# EAGLE design MoteinoR6USB (EAGLE 8.2.0)
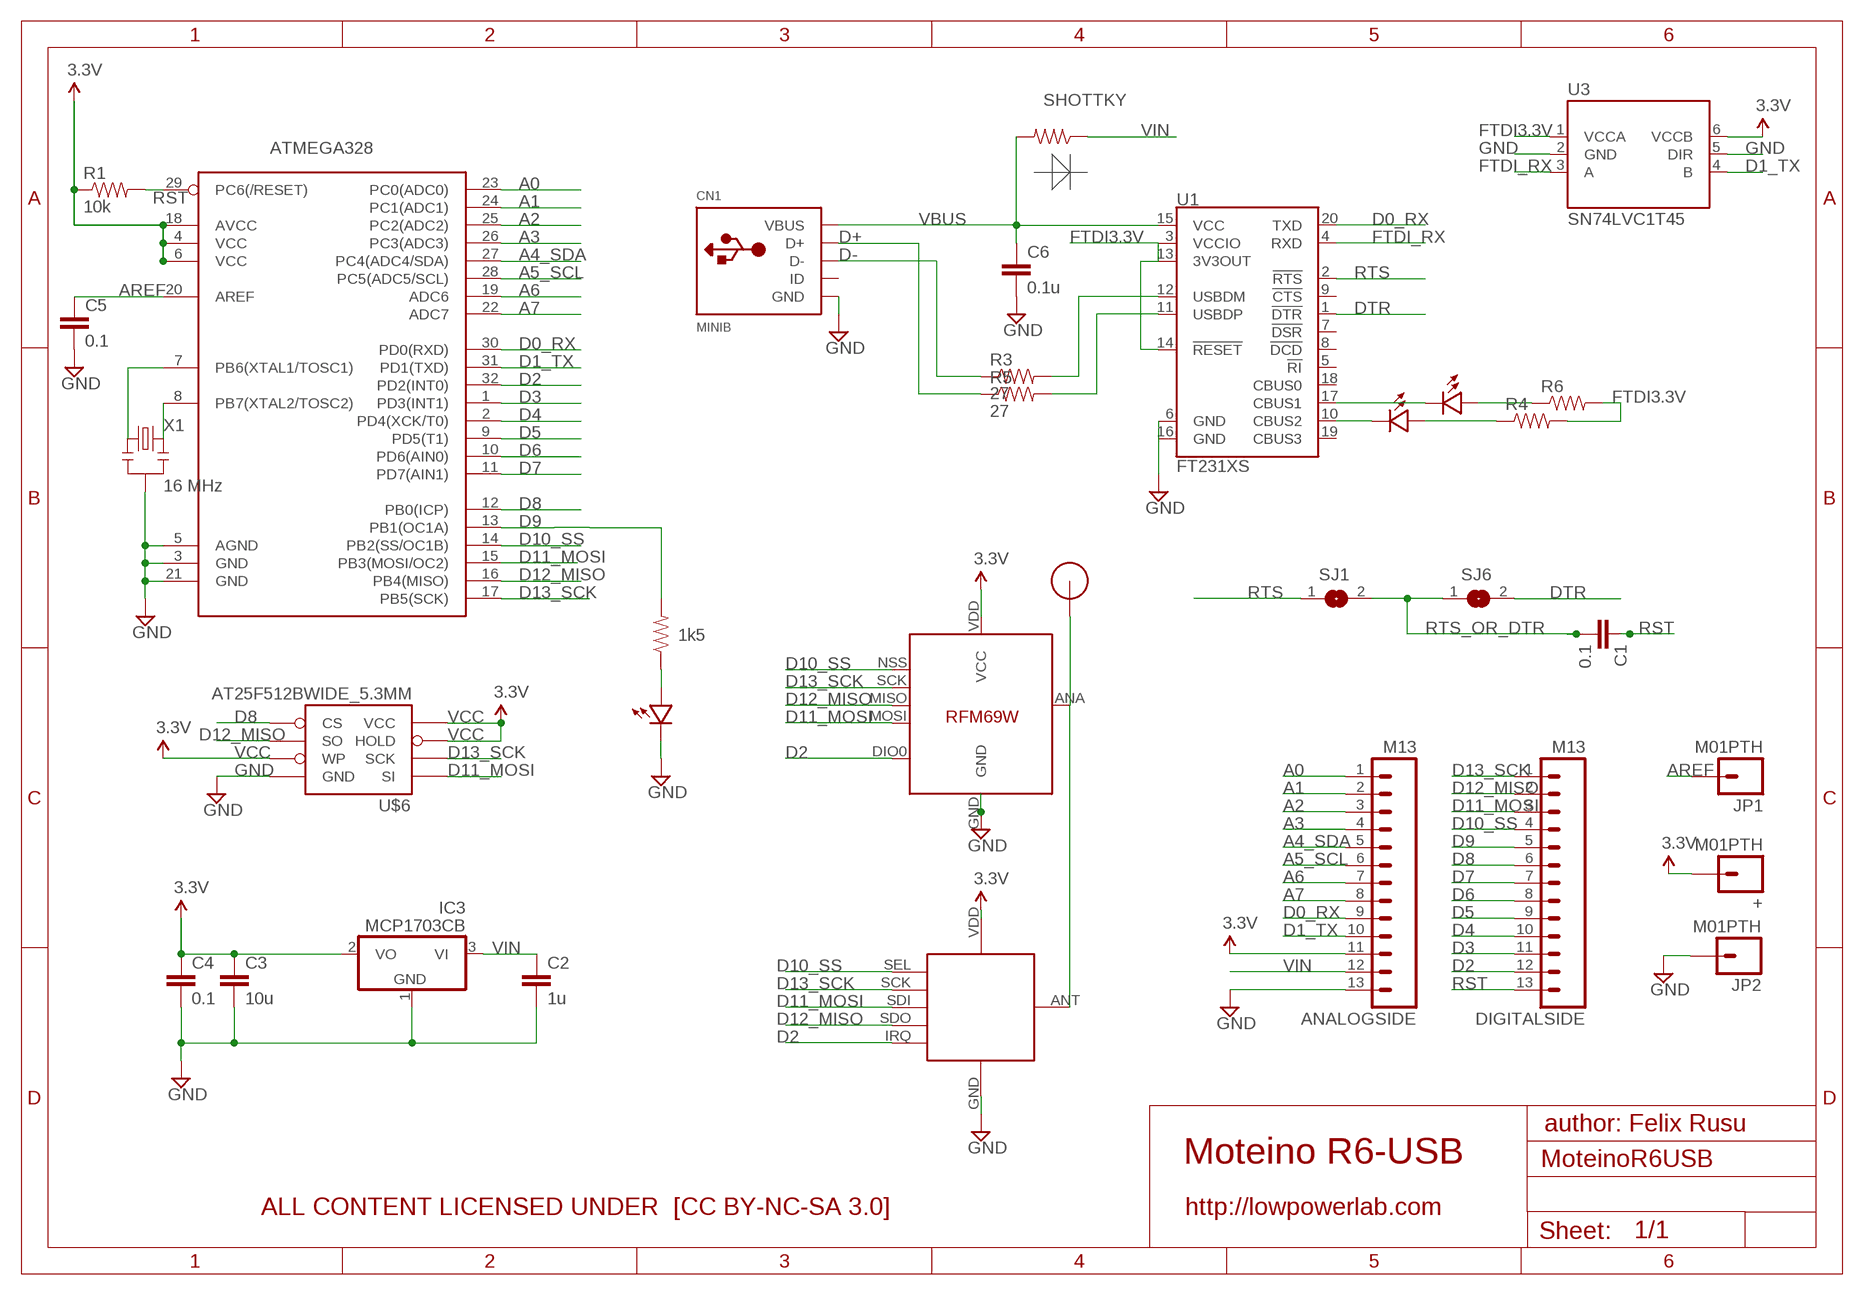
[diagram p0: schematic, sheet 1]

## Parts
+  M01PTH  [1X01]
ANALOGSIDE  M13  [1X13]
ATMEGA328  ATMega-328  ATMEGA168/328TQFP32  [TQFP32-08]
C1  0.1  CAP0603-CAP  [0603-CAP]
C2  1u  CAP0603-CAP  [0603-CAP]
C3  10u  CAP0805-CAP  [0805-CAP]
C4  0.1  CAP0603-CAP  [0603-CAP]
C5  0.1  CAP0603-CAP  [0603-CAP]
C6  0.1u  CAP0603-CAP  [0603-CAP]
CN1  MINIB  USBMINIB  [USB-MINIB]
D  SHOTTKY  RESISTOR0603-RES  [0603-RES]
DIGITALSIDE  M13  [1X13]
IC3  MCP1703CB  [SOT23]
JP1  M01PTH  [1X01]
JP2  M01PTH  [1X01]
R1  10k  RESISTOR0603-RES  [0603-RES]
R2  1k5  RESISTOR0603-RES  [0603-RES]
R3  27  RESISTOR0603-RES  [0603-RES]
R4  RESISTOR0603-RES  [0603-RES]
R5  27  RESISTOR0603-RES  [0603-RES]
R6  RESISTOR0603-RES  [0603-RES]
RFM12B  RFM12B_MINPADS  [RFM12B-MINPADS]
SJ1  JUMPER  [SJW]
SJ6  JUMPER  [SJW]
U1  FT231XS  [SSOP20_L]
U3  SN74LVC1T45  SN74LVC1T45SOT-23  [SOT23-6]
U$1  RFM12B_ANTENNA  [RFM12B-ANTENNA]
U$2  LED0603  [0603-LED]
U$4  LED0603  [0603-LED]
U$5  RFM69  [RFM69W-MINPADS]
U$6  AT25F512BWIDE_5.3MM  [SO08WIDE]
U$7  LED0603  [0603-LED]
X1  16 MHz  RESONATORSMD  [RESONATOR-SMD]

## Nets
A0: ANALOGSIDE.1 ATMEGA328.23(PC0(ADC0))
A1: ANALOGSIDE.2 ATMEGA328.24(PC1(ADC1))
A2: ANALOGSIDE.3 ATMEGA328.25(PC2(ADC2))
A3: ANALOGSIDE.4 ATMEGA328.26(PC3(ADC3))
A4_SDA: ANALOGSIDE.5 ATMEGA328.27(PC4(ADC4/SDA))
A5_SCL: ANALOGSIDE.6 ATMEGA328.28(PC5(ADC5/SCL))
A6: ANALOGSIDE.7 ATMEGA328.19(ADC6)
A7: ANALOGSIDE.8 ATMEGA328.22(ADC7)
AREF: ATMEGA328.20(AREF) C5.1 JP1.1
D0_RX: ANALOGSIDE.9 ATMEGA328.30(PD0(RXD)) U1.20(TXD)
D1_TX: ANALOGSIDE.10 ATMEGA328.31(PD1(TXD)) U3.4(B)
D2: ATMEGA328.32(PD2(INT0)) DIGITALSIDE.12 RFM12B.IRQ U$5.DIO0
D3: ATMEGA328.1(PD3(INT1)) DIGITALSIDE.11
D4: ATMEGA328.2(PD4(XCK/T0)) DIGITALSIDE.10
D5: ATMEGA328.9(PD5(T1)) DIGITALSIDE.9
D6: ATMEGA328.10(PD6(AIN0)) DIGITALSIDE.8
D7: ATMEGA328.11(PD7(AIN1)) DIGITALSIDE.7
D8: ATMEGA328.12(PB0(ICP)) DIGITALSIDE.6 U$6.1(CS)
D9: ATMEGA328.13(PB1(OC1A)) DIGITALSIDE.5 R2.2
D10_SS: ATMEGA328.14(PB2(SS/OC1B)) DIGITALSIDE.4 RFM12B.SEL U$5.NSS(SEL)
D11_MOSI: ATMEGA328.15(PB3(MOSI/OC2)) DIGITALSIDE.3 RFM12B.SDI(SDI/MOSI) U$5.MOSI U$6.5(SI)
D12_MISO: ATMEGA328.16(PB4(MISO)) DIGITALSIDE.2 RFM12B.SDO(SDO/MISO) U$5.MISO U$6.2(SO)
D13_SCK: ATMEGA328.17(PB5(SCK)) DIGITALSIDE.1 RFM12B.SCK U$5.SCK U$6.6(SCK)
D+: CN1.D+ R5.1
D-: CN1.D- R3.1
DTR: SJ6.2 U1.1(!DTR)
FTDI3.3V: R4.2 R6.2 U1.3(VCCIO) U1.13(3V3OUT) U1.14(!RESET) U3.1(VCCA)
FTDI_RX: U1.4(RXD) U3.3(A)
GND [power]: ANALOGSIDE.13 ATMEGA328.3(GND) ATMEGA328.5(AGND) ATMEGA328.21(GND) C2.2 C3.2 C4.2 C5.2 C6.2 CN1.GND IC3.1(GND) JP2.1 RFM12B.GND U1.6(GND) U1.16(GND) U3.2(GND) U3.5(DIR) U$2.MINUS U$5.GND U$6.4(GND) X1.2
N$1: ATMEGA328.7(PB6(XTAL1/TOSC1)) X1.1
N$2: R2.1 U$2.PLUS
N$3: RFM12B.ANT U$1.P$1 U$5.ANA(ANT)
N$4: R3.2 U1.12(USBDM)
N$5: R5.2 U1.11(USBDP)
N$6: U1.17(CBUS1) U$4.MINUS
N$7: U1.10(CBUS2) U$7.MINUS
N$8: R4.1 U$7.PLUS
N$9: R6.1 U$4.PLUS
N$21: ATMEGA328.8(PB7(XTAL2/TOSC2)) X1.3
RST: ATMEGA328.29(PC6(/RESET)) C1.1 DIGITALSIDE.13 R1.2
RTS: SJ1.1 U1.2(!RTS)
RTS_OR_DTR: C1.2 SJ1.2 SJ6.1
VBUS [power]: C6.1 CN1.VBUS D.2 U1.15(VCC)
VCC: +.1 ANALOGSIDE.11 ATMEGA328.4(VCC) ATMEGA328.6(VCC) ATMEGA328.18(AVCC) C3.1 C4.1 IC3.2(VO) R1.1 RFM12B.VDD U3.6(VCCB) U$5.VDD(VCC) U$6.3(WP) U$6.7(HOLD) U$6.8(VCC) ; supply symbol labelled 3.3V
VIN: ANALOGSIDE.12 C2.1 D.1 IC3.3(VI)
Unconnected: CN1.ID U1.5(!RI) U1.7(!DSR) U1.8(!DCD) U1.9(!CTS) U1.18(CBUS0) U1.19(CBUS3)

## Notes on the sheet
- author: Felix Rusu
- Moteino R6-USB
- ALL CONTENT LICENSED UNDER  [CC BY-NC-SA 3.0] | http://lowpowerlab.com

## Library data of the parts
+ JP1 JP2 = SparkFun-Connectors:M01: Header 1 Standard 1-pin 0.1" header. Use with straight break away headers (SKU : PRT-00116), right angle break away headers (PRT-00553), swiss pins (PRT-00743), machine pins (PRT-00117), and female headers (PRT-00115).
ANALOGSIDE DIGITALSIDE = SparkFun-Connectors:M13: 13-pin single row .1" header
ATMEGA328 = LowPowerLab:ATMEGA168/328: Atmel 32-pin 8-bit micro, 16k flash.
C1-C6 = LowPowerLab:CAP: Capacitor Standard 0603 ceramic capacitor, and 0.1" leaded capacitor.
CN1 = LowPowerLab:USB: USB Connectors USBMINIB - Surface Mount Female Mini-B USB Connector 4UConnector: 06564 By microbuilder.eu Thru-hole RA Female Mini-B USB Connector 4UConnector: 18732 By ladyada.net
D R1-R6 = LowPowerLab:RESISTOR: Resistor Basic schematic elements and footprints for 0603, 1206, and PTH resistors.
IC3 = linear:MCP1703: 250 mA, 16V, Low Quiescent Current LDO Regulator Source: http://ww1.microchip.com/downloads/en/DeviceDoc/22049b.pdf
RFM12B = LowPowerLab:RFM12B_MINPADS
SJ1 SJ6 = LowPowerLab:JUMPER
U1 = SparkFun-DigitalIC:FT231X: FTDI FT231X Full Speed USB to Full-handshake UART This USB2.0 Full Speed IC offers a compact bridge to full handshake UART interfaces. The device is a UART, capable of operating up to 3MBaud, with low power consumption (8mA). The FT231X includes the complete FT-X series feature set and enables USB to be added into a system design quickly and easily over a UART interface.; PROD_ID: IC-11524
U3 = SN74LVC1T45:SN74LVC1T45: SN74LVC1T45 Single-Bit Dual-Supply Bus Transceiver With Configurable Voltage Translation and 3-State Outputs Datasheet <http://www.ti.com/lit/ds/symlink/sn74lvc1t45.pdf> Designed by AKstudios <https://github.com/AKstudios>
U$1 = LowPowerLab:RFM12B_ANTENNA
U$2 U$4 U$7 = LowPowerLab:LED
U$5 = LowPowerLab:RFM69
U$6 = LowPowerLab:AT25F512B: 4-Mbit SPI flash memory
X1 = SparkFun:RESONATOR: Resonator Small SMD resonator. This is the itty bitty 10/20MHz resonators with built in caps. CSTCE10M0G55 and CSTCE20M0V53. Footprint has been reviewed closely but hasn't been tested yet.

## Net classes
1 power: width 0.381 mm, clearance 0.254 mm

## Board
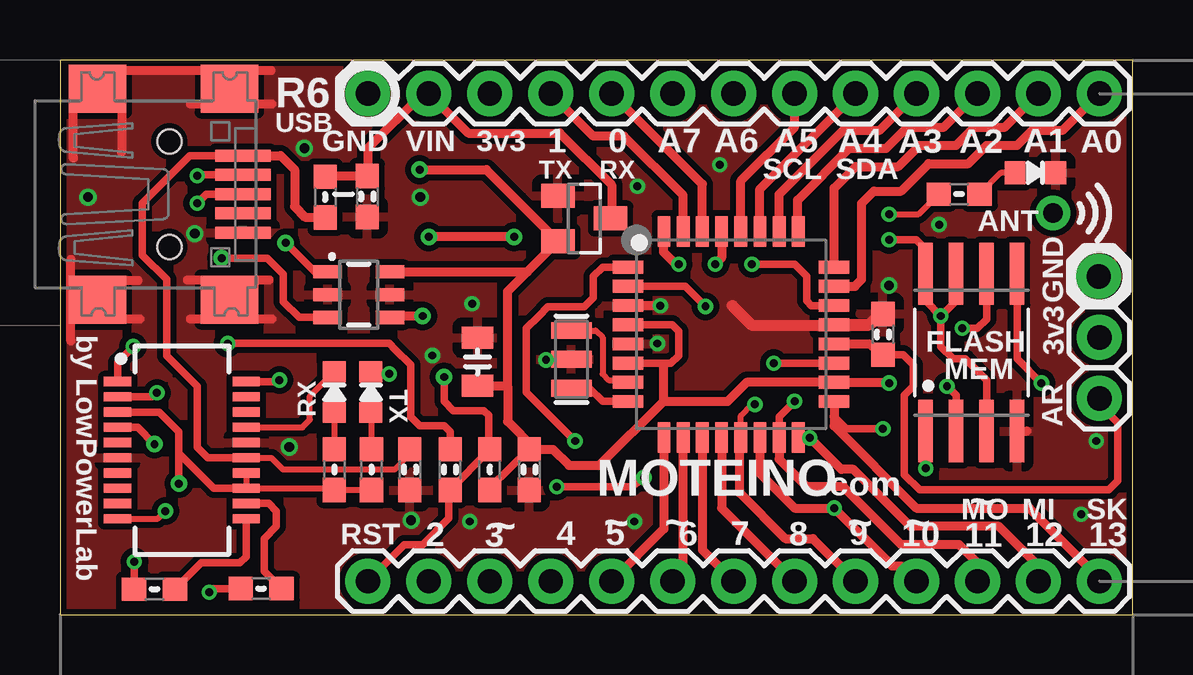
[diagram p1: board, top side]
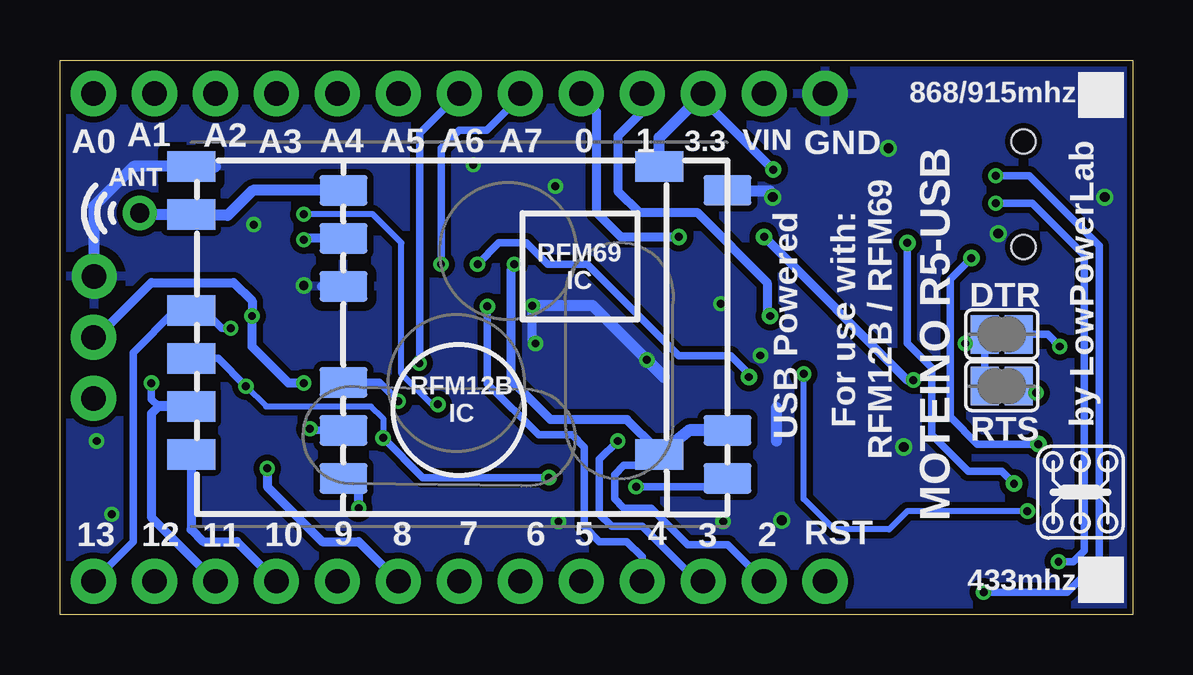
[diagram p2: board, bottom side, seen from below]

Size 44.7 x 23.11 mm. Coordinates in mm from the lower left corner, seen from the top.
Outline: 0,0 44.7,0 44.7,23.11 0,23.11 0,0
Copper layers (1*16): Top 0.035mm / dielectric 1.5mm / Bottom 0.035mm
Design rules "ITEADstudio_DRC *": minimum track width 6mil, minimum drill 12mil, track to track 6mil, track to pad 6mil, pad to pad 6mil, via to via 6mil, smd to smd 0mil, copper to edge 10mil, drill to drill 10mil, minimum pad ring 10mil, minimum via ring 6mil, stop-mask expansion 2mil, vias tented up to drill 100mil, thermal gap 15mil
tRestrict: area 7.1,15.2 to 8,15.7
bRestrict: area 38.7,17.5 to 39.6,18; area 38.7,19.1 to 39.6,19.6; area 31.6,13.3 to 32.1,14.2; area 32.1,12.7 to 32.6,13.6; area 33,12.7 to 33.5,13.6

### Footprints (pad centres in the part's own frame; a part is rotated, then mirrored left to right if it is on the bottom)
1X01 = drill 1.016 pad 1.88: 1 0,0
1X13 = drill 1.016 pad 1.88: 1 0,0; 2 2.54,0; 3 5.08,0; 4 7.62,0; 5 10.16,0; 6 12.7,0; 7 15.24,0; 8 17.78,0; 9 20.32,0; 10 22.86,0; 11 25.4,0; 12 27.94,0; 13 30.48,0
TQFP32-08 = smd 1.27 x 0.533: 1 -4.293,2.8; 2 -4.293,2; 3 -4.293,1.2; 4 -4.293,0.4; 5 -4.293,-0.4; 6 -4.293,-1.2; 7 -4.293,-2; 8 -4.293,-2.8; 17 4.293,-2.8; 18 4.293,-2; 19 4.293,-1.2; 20 4.293,-0.4; 21 4.293,0.4; 22 4.293,1.2; 23 4.293,2; 24 4.293,2.8 | smd 0.533 x 1.27: 9 -2.8,-4.293; 10 -2,-4.293; 11 -1.2,-4.293; 12 -0.4,-4.293; 13 0.4,-4.293; 14 1.2,-4.293; 15 2,-4.293; 16 2.8,-4.293; 25 2.8,4.293; 26 2,4.293; 27 1.2,4.293; 28 0.4,4.293; 29 -0.4,4.293; 30 -1.2,4.293; 31 -2,4.293; 32 -2.8,4.293
0603-CAP = smd 1.016 x 0.965: 1 -0.85,0; 2 0.85,0
0805-CAP = smd 0.902 x 1.3: 1 -1,0; 2 1,0
USB-MINIB = smd 0.5 x 2.308: D+ 0,4.064; D- -0.8,4.064; GND 1.6,4.064; ID 0.8,4.064; VBUS -1.6,4.064 | smd 2 x 2.4: GND1 -4.4,-2; GND2 -4.4,3.5; GND3 4.4,3.5; GND4 4.4,-2 | hole 1: -2.2,1; 2.2,1
0603-RES = smd 1.016 x 0.965: 1 -0.85,0; 2 0.85,0
SOT23 = smd 1 x 1.4: 1 -0.95,-1.1; 2 0.95,-1.1; 3 0,1.1
RFM12B-MINPADS = smd 2 x 1.27: ANT 8,-6; GND 8,-2; IRQ -8,4; SCK 8,4; SDI 8,2; SDI1 -8.002,-6.001; SDO -8,6; SEL 8,6; VDD 8,-4
SJW = smd 1.168 x 1.6: 1 -0.711,0; 2 0.711,0
SSOP20_L = smd 0.381 x 1.143: 1 -2.857,-2.68; 2 -2.223,-2.68; 3 -1.587,-2.68; 4 -0.953,-2.68; 5 -0.318,-2.68; 6 0.318,-2.68; 7 0.953,-2.68; 8 1.587,-2.68; 9 2.223,-2.68; 10 2.857,-2.68; 11 2.857,2.68; 12 2.223,2.68; 13 1.587,2.68; 14 0.953,2.68; 15 0.318,2.68; 16 -0.318,2.68; 17 -0.953,2.68; 18 -1.587,2.68; 19 -2.223,2.68; 20 -2.857,2.68
SOT23-6 = smd 0.55 x 1.2: 1 0.95,1.3; 2 0,1.3; 3 -0.95,1.3; 4 -0.95,-1.3; 5 0,-1.3; 6 0.95,-1.3
RFM12B-ANTENNA = drill 0.8 pad 1.422: P$1 0,0
0603-LED = smd 0.864 x 0.965: MINUS -0.85,0; PLUS 0.85,0
RFM69W-MINPADS = smd 2 x 1.27: ANA 8,-5; DIO0 -11.5,5; GND 8,-7; MISO 8,1; MOSI 8,3; NSS 8,5; SCK 8,-1; VDD -11.5,-7
SO08WIDE = smd 0.61 x 2.6: 1 -1.905,-3.269; 2 -0.635,-3.269; 3 0.635,-3.269; 4 1.905,-3.269; 5 1.905,3.286; 6 0.635,3.286; 7 -0.635,3.286; 8 -1.905,3.286
RESONATOR-SMD = smd 0.7 x 1.7: 1 -1.2,0; 2 0,0; 3 1.2,0

### Placement (x,y rotation side)
+  43.31,11.56 270 top
ANALOGSIDE  43.31,21.72 180 top
ATMEGA328  27.97,11.68 0 top
C1  16.26,6.05 90 top
C2  12.8,17.42 270 top
C3  17.4,10.54 90 top
C4  19.56,6.05 270 top
C5  34.29,11.68 90 top
C6  14.58,6.05 270 top
CN1  3.56,17.53 270 top
D  11.05,17.4 270 top
DIGITALSIDE  43.31,1.4 180 top
IC3  21.84,16.51 270 top
JP1  43.31,9.02 0 top
JP2  43.28,14.1 0 top
R1  17.91,6.05 90 top
R2  37.46,17.53 180 top
R3  8.38,1.09 0 top
R4  12.98,6.05 270 top
R5  3.94,1.07 0 top
R6  11.43,6.05 270 top
RFM12B  24.89,11.68 180 bottom
SJ1  5.46,9.53 180 bottom
SJ6  5.46,11.68 0 bottom
U1  5.08,6.86 270 top
U3  12.45,13.34 90 top
U$1  41.38,16.74 0 top
U$2  40.64,18.41 180 top
U$3  [LOGO_LOWPOWERLAB]  2.18,5.11 270 bottom
U$4  11.43,9.27 270 top
U$5  31.24,11.68 180 bottom
U$6  37.97,10.92 0 top
U$7  12.95,9.27 270 top
X1  21.31,10.64 270 top

### Tracks (layer width: path | path; a pad name or v marks a point on that pad's centre or on a via)
A0
  Top 0.381: ATMEGA328.23 33.11,13.68 33.4,13.97 33.4,17.14 33.91,17.65 35.05,17.65 36.2,18.8 37.85,18.8 38.61,19.56 39.88,19.56 40.51,20.19 41.78,20.19 ANALOGSIDE.1
A1
  Top 0.381: ATMEGA328.24 32.26,17.78 33.15,18.67 34.92,18.67 35.81,19.56 37.34,19.56 38.1,20.32 39.37,20.32 ANALOGSIDE.2
A2
  Top 0.381: ATMEGA328.25 30.73,15.98 30.73,17.27 32.89,19.43 34.42,19.43 35.31,20.32 36.83,20.32 ANALOGSIDE.3
A3
  Top 0.381: ATMEGA328.26 29.96,17.52 32.64,20.19 34.16,20.19 ANALOGSIDE.4
A4_SDA
  Top 0.381: ATMEGA328.27 29.16,17.73 ANALOGSIDE.5
A5_SCL
  Top 0.381: ATMEGA328.28 28.36,18.08 30.61,20.32 ANALOGSIDE.6
A6  (via drill 0.33)
  Top 0.305: ATMEGA328.19 v29.74,10.48
  Bottom 0.305: 29.72,10.41 29.72,20.07 ANALOGSIDE.7
  Bottom 0.381: 29.72,10.41 v29.74,10.48
A7  (via drill 0.33)
  Top 0.305: ATMEGA328.22 31.31,12.88 31.11,13.08 31.11,14.1 30.61,14.61 v28.83,14.61
  Bottom 0.305: v28.83,14.61 28.83,19.43 28.07,20.19 26.92,20.19 25.53,21.59 ANALOGSIDE.8
AREF
  Top 0.305: C5.1 35.14,10.83 35.56,10.41 35.56,9.53 35.18,9.14 35.18,5.84 35.81,5.21 43.69,5.21 44.07,5.59 44.07,8 43.31,8.76 JP1.1
  Top 0.381: ATMEGA328.20 33.71,11.28 C5.1
D0_RX  (via drill 0.33, 0.33 pad 0.69)
  Top 0.254: 9.08,9.72 v9.14,9.78
  Top 0.305: U1.20 9.08,9.72
  Top 0.381: ATMEGA328.30 26.77,17.94 ANALOGSIDE.9 | v18.92,15.75 v15.37,15.75
  Bottom 0.381: 23.11,21.59 ANALOGSIDE.9 22.99,21.59 22.35,20.95 22.35,16.76 21.34,15.75 v18.92,15.75 | v9.14,9.78 9.4,9.78 v15.37,15.75
D1_TX  (via drill 0.33 pad 0.69)
  Top 0.381: ATMEGA328.31 25.96,17.47 23.49,19.94 22.22,19.94 ANALOGSIDE.10 | v15.11,12.45 13.81,12.45 U3.4
  Bottom 0.381: ANALOGSIDE.10 20.45,20.95 21.46,19.94 21.46,17.65 20.57,16.76 18.16,16.76 15.24,13.84 15.24,12.57 v15.11,12.45
D2  (via drill 0.33)
  Top 0.381: v25.78,14.61 25.65,14.61 25.15,15.11 25.15,15.83 ATMEGA328.32
  Bottom 0.305: DIGITALSIDE.12 16.89,2.92 18.54,2.92 20.07,4.45 21.21,4.45 21.59,4.83 21.59,5.84 21.21,6.22 20.2,6.22 U$5.DIO0
  Bottom 0.381: 19.28,6.89 19.84,6.89 21.08,8.13 24.26,8.13 25.91,9.78 25.91,14.35 v25.78,14.61
  Bottom 0.406: U$5.DIO0 19.48,6.68 19.28,6.89
  Bottom 0.508: RFM12B.IRQ 18.49,7.68 U$5.DIO0
D3  (via drill 0.33)
  Top 0.305: v21.46,7.24 19.43,9.27 19.43,11.05 19.43,11.94 19.94,12.45 20.32,12.83 21.84,12.83 22.22,13.21 22.22,14.1 22.61,14.48 ATMEGA328.1
  Top 0.381: ATMEGA328.1
  Bottom 0.305: DIGITALSIDE.11 18.16,1.4 20.45,3.68 21.72,3.68 22.22,4.19 22.22,6.48 v21.46,7.24
D4  (via drill 0.33)
  Top 0.305: ATMEGA328.2 26.06,13.68 v26.89,12.85
  Top 0.381: 23.6,13.73 ATMEGA328.2
  Bottom 0.305: DIGITALSIDE.10 20.45,2.41 21.08,3.05 22.22,3.05 22.86,3.68 22.86,6.99 23.37,7.49 24.77,7.49 26.89,9.62 v26.89,12.85
D5
  Top 0.381: ATMEGA328.9 25.16,3.58 DIGITALSIDE.9
D6
  Top 0.381: DIGITALSIDE.8 25.96,1.83 ATMEGA328.10
D7
  Top 0.381: ATMEGA328.11 26.77,2.7 DIGITALSIDE.7
D8  (via drill 0.33)
  Top 0.305: v36.07,6.1 36.05,7.75 U$6.1
  Top 0.381: ATMEGA328.12 27.56,4.44 DIGITALSIDE.6
  Bottom 0.381: v36.07,6.1 36.07,5.33 33.78,3.05 32.26,3.05 DIGITALSIDE.6
D9  (via drill 0.33)
  Top 0.254: ATMEGA328.13 28.36,8.3 28.83,8.76 v28.96,8.76 | v34.54,16.69 35.78,16.69 R2.2
  Top 0.381: ATMEGA328.13 28.32,7.31 28.32,5.08 30.23,3.17 31.37,3.17 DIGITALSIDE.5
  Bottom 0.254: v28.96,8.76 29.21,8.76 30.48,10.03 30.48,15.49 31.67,16.69 v34.54,16.69
D10_SS  (via drill 0.33)
  Top 0.381: ATMEGA328.14 29.16,5.89 30.61,4.45 v32.26,4.45 34.67,2.03 35.05,2.03 DIGITALSIDE.4
  Bottom 0.254: 32.26,5.43 RFM12B.SEL
  Bottom 0.381: v32.26,4.45 32.26,5.43 | U$5.NSS 39.24,3.56 38.73,3.05 37.34,3.05 DIGITALSIDE.4
D11_MOSI  (via drill 0.33)
  Top 0.305: v40.89,9.65 39.88,10.67 U$6.5 | ATMEGA328.15 29.96,8.25 v30.61,8.89
  Top 0.381: ATMEGA328.15 29.96,6.48 31.11,5.33 32.64,5.33 35.05,2.92 37.46,2.92 38.23,2.16 DIGITALSIDE.3
  Bottom 0.305: v40.89,9.65 40.89,8.99 40.59,8.68 | v30.61,8.89 31.4,9.68 RFM12B.SDI
  Bottom 0.381: 40.59,8.68 40.89,8.38 40.89,4.06 DIGITALSIDE.3
  Bottom 0.406: U$5.MOSI 40.59,8.68
D12_MISO  (via drill 0.33)
  Top 0.305: v36.96,9.53 37.34,9.14 37.34,8.51 U$6.2 | v20.7,5.33 23.82,5.33 v24.33,5.71
  Top 0.381: ATMEGA328.16 31.34,7.39 v31.24,7.37 32.55,6.06 33.06,6.06 35.43,3.68 39.12,3.68 40.77,2.03 DIGITALSIDE.2
  Bottom 0.254: v36.96,9.53 36.12,8.69 31.75,8.69 31.24,8.18 v31.24,7.37
  Bottom 0.305: U$5.MISO 38.12,10.68 v36.96,9.53 37.27,9.84 | v31.24,7.37 29.59,5.71 v24.33,5.71 | v20.7,5.33 17.24,5.33 RFM12B.SDO
D13_SCK  (via drill 0.33)
  Top 0.305: v37.59,11.94 38.23,11.94 38.61,12.32 U$6.6 | v34.29,7.75 32.77,7.75 32.26,8.26
  Top 0.381: DIGITALSIDE.1 43.31,1.52 40.39,4.45 35.68,4.45 32.26,7.87 32.26,8.26 ATMEGA328.17
  Bottom 0.305: RFM12B.SCK 34.23,7.68 v34.29,7.75 | DIGITALSIDE.1 41.66,3.05 41.66,10.92 39.89,12.68 U$5.SCK 39.23,12.7 38.73,12.7 37.97,11.94 v37.59,11.94
D+  (via drill 0.33)
  Top 0.305: CN1.D+ 6.1,17.53 v5.71,17.14 | v3.1,2.21 3.09,2.2 R5.1
  Bottom 0.305: v5.71,17.14 4.19,17.14 2.03,14.99 2.03,2.67 2.49,2.21 v3.1,2.21
D-  (via drill 0.33)
  Top 0.305: CN1.D- 6.01,18.33 v5.71,18.29 | v6.22,0.94 6.37,1.09 R3.1
  Bottom 0.305: v5.71,18.29 4.32,18.29 1.4,15.37 1.4,2.29 2.74,0.94 v6.22,0.94
DTR  (via drill 0.33)
  Top 0.305: U1.1 2.4,10.53 v3.05,11.18
  Bottom 0.305: v3.05,11.18 3.56,11.68 SJ6.2 5.21,11.68 5.84,11.68
FTDI3.3V  (via drill 0.33 pad 0.69)
  Top 0.254: U1.14 U1.13 11.35,5.27 R6.2 R4.2
  Top 0.305: 11.42,5.21 R6.2 | U1.3 4.13,8.45 4.95,7.62 4.95,6.73 | U1.13 6.41,5.27 4.95,6.73 | U3.1 10.61,14.29 v9.4,15.49 | v4.95,5.46 4.95,6.73
  Bottom 0.305: v9.4,15.49 9.4,11.3 8.38,10.29 8.38,7.49 6.86,5.97 5.46,5.97 v4.95,5.46
FTDI_RX  (via drill 0.33 pad 0.69)
  Top 0.305: U1.4 3.24,7.81 v3.94,7.11 | v6.73,14.86 8.64,14.86 9.31,14.19 9.31,13.04 9.97,12.38 U3.3
  Bottom 0.305: v6.73,14.86 7.62,13.97 7.62,8.26 6.48,7.11 v3.94,7.11
GND  (via drill 0.33, 0.38, 0.41)
  Top 0.381: 32.37,12.06 ATMEGA328.21 | v25.02,12.88 ATMEGA328.3 | 27.96,12.88 28.02,12.88 | U$6.4 40.29,7.65 | v20.25,10.62 X1.2 | 2.56,22.68 8.79,22.68 | 5.44,21.29 8.84,21.29 | 0.61,22.68 2.56,22.68 | 0.56,19.02 0.56,22.43 | 2.56,22.68 2.56,19.28 | 0.46,11.4 0.46,14.81 | 3.25,13.92 1.45,13.92 | 8.84,12.32 5.44,12.32 | 8.71,13.95 5.31,13.95 | 3.33,12.32 1.52,12.32
  Top 0.457: 32.37,12.06 28.83,12.06 28.02,12.88 | 43.81,14.63 JP2.1
  Top 0.508: ATMEGA328.21 33.71,12.08 C5.2 34.42,12.41
  Bottom 0.381: 25.02,12.81 v25.02,12.88 25.02,11.3 v24.89,11.3 | RFM12B.GND 33.81,13.68
  Bottom 0.457: 38.24,18.68 41.64,18.68 43.31,17.02 43.31,14.12 JP2.1 | v20.25,10.62 22.51,12.88 v25.02,12.88 | 14.86,8.64 14.86,7.24 | 15.11,17.65 16.48,17.65
  Bottom 0.508: U$5.GND 38.24,18.68 | 19.54,9.91 v20.25,10.62
  other vias: 34.54,13.72 17.08,3.89 23.93,3.89 24.06,17.86 27.49,18.75 36.63,16.26 43.18,7.24 42.54,4.19 1.17,17.4 15.01,17.4 14.63,3.94 15.52,10.8 17.17,12.96 10.18,19.44 5.61,15.88 9.55,6.99
  pour Bottom: -0.51,24 -0.51,-0.76 45.47,-0.76 45.47,24
  pour Top: -0.51,24 -0.51,-0.76 45.47,-0.76 45.47,24
N$1
  Top 0.254: X1.1 22.32,11.84 22.61,11.56 22.61,10.03 22.86,9.78 23.58,9.78 ATMEGA328.7
N$2
  Top 0.254: U$2.PLUS 39.2,18.41 R2.1
N$3
  Bottom 0.305: U$1.P$1 41.32,16.68
  Bottom 0.381: 38.94,16.64 U$5.ANA
  Bottom 0.457: RFM12B.ANT 36.67,17.68 37.72,16.64 38.94,16.64 | 41.32,16.68 U$5.ANA
N$4
  Top 0.305: R3.2 9.14,1.18 8.51,1.81 8.51,3.17 9.02,3.68 9.02,4.32 8.7,4.64 U1.12
N$5
  Top 0.305: R5.2 5.88,2.16 7.49,2.16 7.76,2.43 U1.11
N$6
  Top 0.254: U1.17 10.1,7.81 10.41,8.13 10.41,9.11 U$4.MINUS
  Top 0.305: 11.39,9.91 U$4.MINUS
N$7  (via drill 0.33)
  Top 0.254: U1.10 4.08,4 v4.39,4.32 | v13.72,10.03 13.04,10.03 U$7.MINUS
  Bottom 0.254: v4.39,4.32 9.4,4.32 10.16,3.56 12.45,3.56 13.72,4.83 v13.72,10.03
N$8
  Top 0.254: U$7.PLUS R4.1
N$9
  Top 0.254: U$4.PLUS R6.1
N$21
  Top 0.254: ATMEGA328.8
  Top 0.305: X1.3 22.05,9.44 22.61,8.89 ATMEGA328.8
RST  (via drill 0.33, 0.33 pad 0.69)
  Top 0.305: DIGITALSIDE.13 14.35,2.92 15.11,2.92 16.2,4.01 16.2,5.2 C1.1 17.86,6.85 17.86,7 | 17.86,7 17.86,8.31 17.65,8.51 16.38,8.51 16,8.89 v16,9.91 | 17.86,7 R1.2
  Top 0.381: ATMEGA328.29 27.56,14.87 v27.3,14.61
  Bottom 0.305: v27.3,14.61 26.42,15.49 25.27,15.49 24.38,14.61 22.73,14.61 18.92,10.79 16.76,10.79 16,10.03 v16,9.91
RTS  (via drill 0.33)
  Top 0.305: U1.2 3.82,9.08 v4.04,9.25
  Bottom 0.305: v4.04,9.25 SJ1.1
RTS_OR_DTR  (via drill 0.33)
  Top 0.305: C1.2 16.26,7.62 16,7.87 14.99,7.87 14.6,8.26 14.6,10.41 13.97,11.05 13.72,11.3 v6.99,11.3
  Bottom 0.305: v6.99,11.3 SJ6.1 SJ1.2
VBUS
  Top 0.254: C6.1 14.58,6.68 13.94,6.04 9.3,6.04 8.81,6.53 7.77,6.53 U1.15
  Top 0.305: CN1.VBUS 5.41,19.13 3.43,17.14 3.43,14.99 4.44,13.97 4.44,10.79 5.71,9.53 5.71,6.99 6.16,6.54 U1.15
  Top 0.381: D.2 10.25,16.55 9.78,17.02 9.78,18.54 9.19,19.13 CN1.VBUS
  Top 0.406: 6.78,19.13 CN1.VBUS
VCC  (via drill 0.33, 0.33 pad 0.69)
  Top 0.305: ATMEGA328.4 25.51,12.08 25.78,11.81 25.78,10.79 25.46,10.48 25.27,10.48 | ATMEGA328.6 25.27,10.48 | v36.7,12.45 36.07,13.08 U$6.8 | v36.7,12.45 37.34,13.08 U$6.7 | v36.7,12.45 36.7,11.18 37.21,10.67 37.72,10.67 38.61,9.78 U$6.3 | v34.54,15.62 35.67,15.62 36.07,15.22 | 25.15,10.36 25.27,10.48 | R1.1 17.86,5.32 17.93,5.32 C4.1
  Top 0.381: 36.07,15.22 U$6.8 | 34.64,9.68 ATMEGA328.18 28.61,9.68 27.81,8.89 25.15,8.89 | 25.15,8.89 25.15,10.36 | 19.81,6.89 C4.1 | 19.81,6.89 20.54,6.89 21.21,6.22 22.48,6.22 25.15,8.89 | 19.47,14.29 18.65,13.47 18.65,9.53 | 19.47,14.29 IC3.2 17.76,18.54 v14.99,18.54 | U3.6 19.47,14.29 | 19.81,6.89 18.65,8.05 18.65,9.53 | C3.1 18.64,9.54 18.65,9.53
  Top 0.457: 34.64,9.68 v34.54,9.65
  Bottom 0.381: +.1 43.18,11.56 40.89,13.84 37.46,13.84 36.7,13.08 v36.7,12.45 36.7,11.18 35.18,9.65 v34.54,9.65 | RFM12B.VDD 34.61,15.68 v34.54,15.62 | ANALOGSIDE.11 17.91,21.46 v14.99,18.54
  Bottom 0.457: U$5.VDD 19.74,19.88 ANALOGSIDE.11
VIN
  Top 0.381: IC3.3 22.99,16.55 22.99,17.91 20.83,20.07 17.02,20.07 ANALOGSIDE.12 15.11,21.72 12.83,19.43 12.83,18.3 C2.1 11.07,18.27 D.1

### Text on the board
tPlace: R6 | USB | GND | VIN | 3v3 | 1 | 0 | A7 | A6 | A5 | A4 | A3 | A2 | A1 | A0 | TX | RX | SCL | SDA | ANT | GND | 3v3 | by LowPowerLab | FLASH | MEM | AR | TX | RX | MOTEINO | .com | ~ | 2 | 3 | ~ | 4 | 5 | ~ | ~ | 6 | 7 | 8 | 9 | ~ | ~ | 10 | MO | 11 | MI | 12 | SK | 13 | RST
bPlace: 868/915mhz | A1 | VIN | 3.3 | 1 | 0 | A7 | A6 | A5 | A4 | A3 | A2 | A0 | GND | ANT | by LowPowerLab | RFM69 / IC | DTR | MOTEINO R5-USB | For use with: / RFM12B / RFM69 | USB Powered | RFM12B / IC | RTS | 2 | 3 | 4 | 5 | 6 | 7 | 8 | 9 | 10 | 11 | 12 | 13 | RST | 433mhz
tDocu: All dimensions in mils | Moteino-USB